# Altium schematic sheet Button.SchDoc
size A4; SheetNumber: 1; SheetTotal: 1
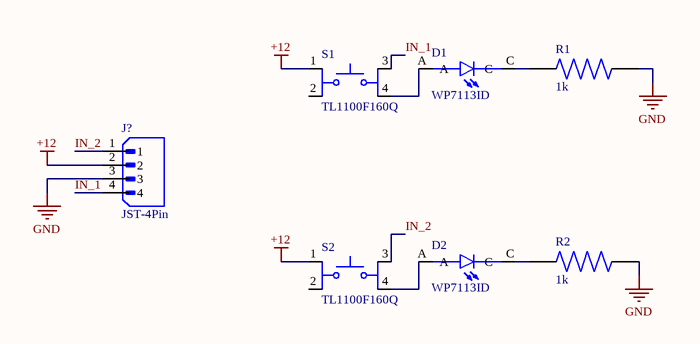
[diagram p0: Button.SchDoc]

## Parts
D1  WP7113ID  [LED_WP7113ID]
D2  WP7113ID  [LED_WP7113ID]
J?  JST-4Pin  [4Pin-M-Header_3MX1-254MM]
R1  1k  [Resistor_0805]
R2  1k  [Resistor_0805]
S1  TL1100F160Q  [SW_TL1100F160Q]
S2  TL1100F160Q  [SW_TL1100F160Q]

## Nets
+12: J?.2 S1.1 S2.1
GND: J?.3 R1.2 R2.2
IN_1: J?.4 S1.3
IN_2: J?.1 S2.3
NetD1_A: D1.A S1.4
NetD1_C: D1.C R1.1
NetD2_A: D2.A S2.4
NetD2_C: D2.C R2.1

Not connected (* = marked no-connect by the designer): S1 2; S2 2

## Library data of the parts
D1 D2 = WP7113ID: Red 617nm LED Indication - Discrete 2V Radial; MF: Kingbright; Price: None; MP: WP7113ID; Package: Radial Kingbright; Check_prices: https://www.snapeda.com/parts/WP7113ID/Kingbright/view-part/?ref=eda; Purchase-URL: https://pricing.snapeda.com/search/part/WP7113ID/?ref=eda; Availability: In Stock; Value: *; SnapEDA_Link: https://www.snapeda.com/parts/WP7113ID/Kingbright/view-part/?ref=snap
J? = JST-4Pin: Connector Header Through Hole 4 position 0.098 (2.50mm); MF: JST Sales; MP: B4B-XH-A(LF)(SN); SnapEDA_Link: https://www.snapeda.com/parts/B4B-XH-A(LF)(SN)/JST+Sales+America+Inc./view-part/?ref=snap; Package: None; Value: *; Check_prices: https://www.snapeda.com/parts/B4B-XH-A(LF)(SN)/JST+Sales+America+Inc./view-part/?ref=eda
R1 R2 = Resistor_0805: Res 0805 330R 5% 125mW | Bourns CR0805-JW-331ELF; SnapEDA_Link: https://www.snapeda.com/parts/CR0805-JW-331ELF/Bourns/view-part/?ref=snap; Package: 0805 Bourns; Value: *; MF: Bourns; MP: CR0805-JW-331ELF; Check_prices: https://www.snapeda.com/parts/CR0805-JW-331ELF/Bourns/view-part/?ref=eda
S1 S2 = TL1100F160Q: Tactile Switch, TL1100 Series, SPST-NO, 12mm Top Actuated, 0.05A, 12VDC, PC | E-Switch TL1100F160Q; SnapEDA_Link: https://www.snapeda.com/parts/TL1100F160Q/E-Switch/view-part/?ref=snap; Package: None; Value: *; MF: E-Switch; MP: TL1100F160Q; Check_prices: https://www.snapeda.com/parts/TL1100F160Q/E-Switch/view-part/?ref=eda